# EAGLE schematic testing (EAGLE 9.2.2)
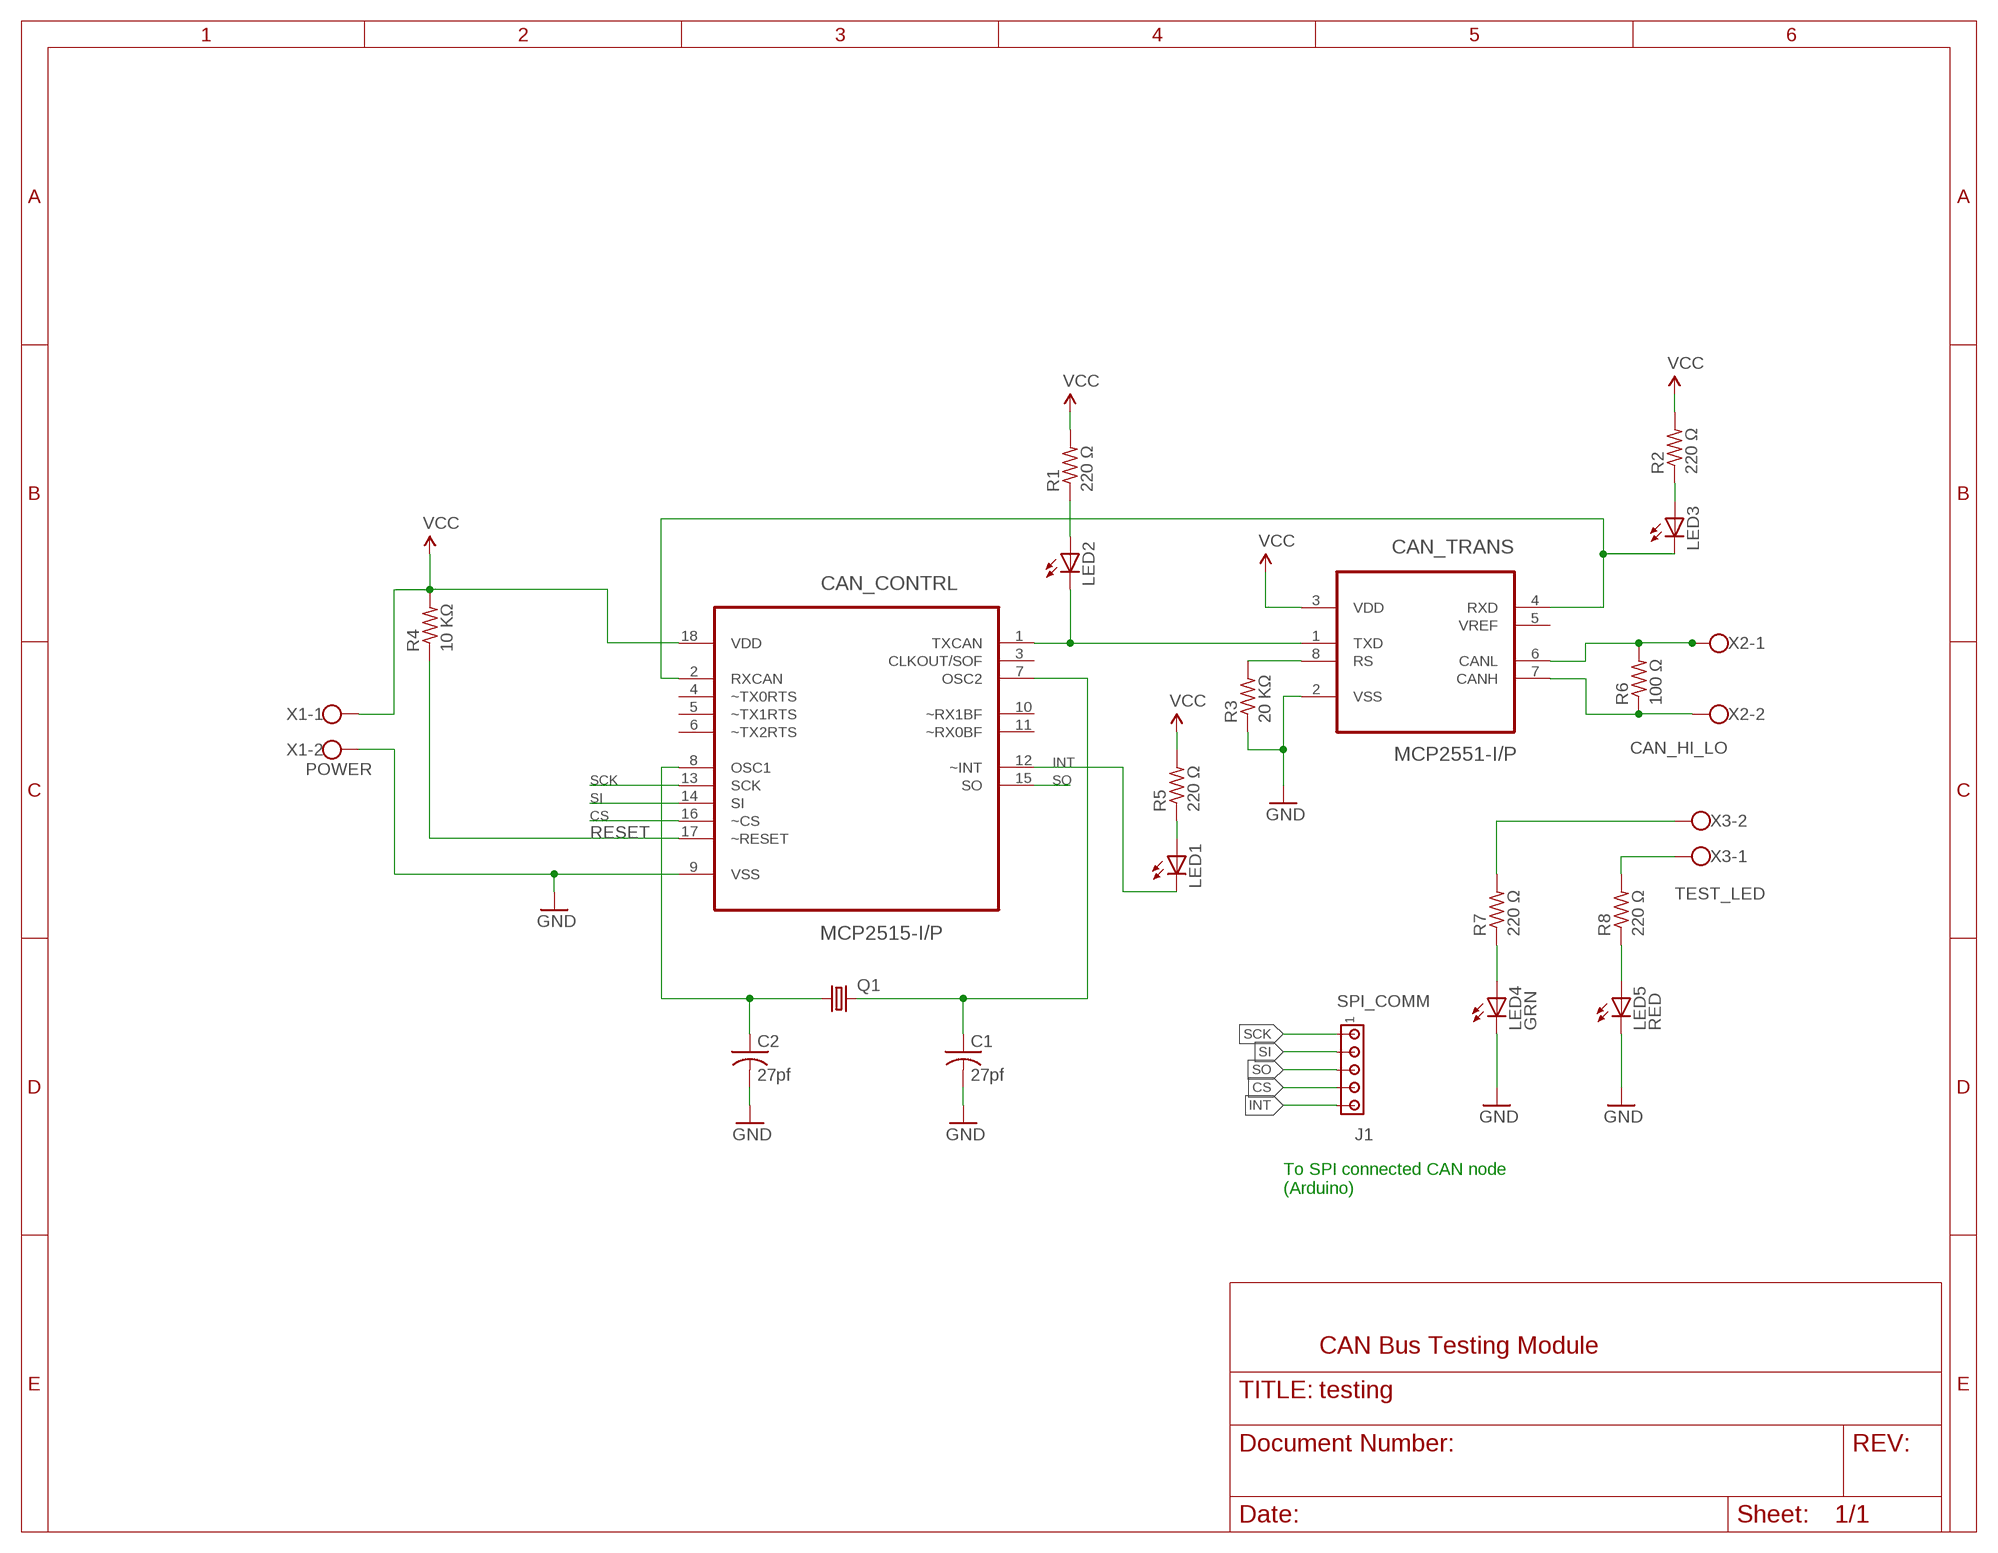
[diagram p0: schematic, sheet 1]

## Parts
C1  27pf  C-US025-040X050  [C025-040X050]
C2  27pf  C-US025-040X050  [C025-040X050]
CAN_CONTRL  MCP2515-I/P  [DIP254P762X432-18]
CAN_TRANS  MCP2551-I/P  [DIP254P762X432-8]
J1  SPI_COMM  MTA05-156  [1X5MTA]
LED1  LED5MM  [LED5MM]
LED2  LED5MM  [LED5MM]
LED3  LED5MM  [LED5MM]
LED4  GRN  LED5MM  [LED5MM]
LED5  RED  LED5MM  [LED5MM]
Q1  CRYTALHC18U-V  [HC18U-V]
R1  220 Ω  R-US_0204/7  [0204/7]
R2  220 Ω  R-US_0204/7  [0204/7]
R3  20 KΩ  R-US_0204/7  [0204/7]
R4  10 KΩ  R-US_0204/7  [0204/7]
R5  220 Ω  R-US_0204/7  [0204/7]
R6  100 Ω  R-US_0204/7  [0204/7]
R7  220 Ω  R-US_0204/7  [0204/7]
R8  220 Ω  R-US_0204/7  [0204/7]
X1  POWER  W237-102  [W237-102]
X2  CAN_HI_LO  W237-102  [W237-102]
X3  TEST_LED  W237-102  [W237-102]

## Nets
CAN_H: CAN_TRANS.7(CANH) R6.1 X2.2
CAN_L: CAN_TRANS.6(CANL) R6.2 X2.1
CS: CAN_CONTRL.16(~CS) J1.4
GND [power]: C1.2 C2.2 CAN_CONTRL.9(VSS) CAN_TRANS.2(VSS) LED4.K(C) LED5.K(C) R3.1 X1.2
INT: CAN_CONTRL.12(~INT) J1.5 LED1.K(C)
N$1: R7.2 X3.2
N$2: R8.2 X3.1
N$3: C2.1 CAN_CONTRL.8(OSC1) Q1.1
N$4: C1.1 CAN_CONTRL.7(OSC2) Q1.2
N$5: LED1.A R5.1
N$6: LED2.A R1.1
N$7: LED4.A R7.1
N$9: LED3.A R2.1
N$10: LED5.A R8.1
N$13: CAN_TRANS.8(RS) R3.2
RESET: CAN_CONTRL.17(~RESET) R4.1
RXCAN: CAN_CONTRL.2(RXCAN) CAN_TRANS.4(RXD) LED3.K(C)
SCK: CAN_CONTRL.13(SCK) J1.1
SI: CAN_CONTRL.14(SI) J1.2
SO: CAN_CONTRL.15(SO) J1.3
TXCAN: CAN_CONTRL.1(TXCAN) CAN_TRANS.1(TXD) LED2.K(C)
VCC [power]: CAN_CONTRL.18(VDD) CAN_TRANS.3(VDD) R1.2 R2.2 R4.2 R5.2 X1.1
Unconnected: CAN_CONTRL.3(CLKOUT/SOF) CAN_CONTRL.4(~TX0RTS) CAN_CONTRL.5(~TX1RTS) CAN_CONTRL.6(~TX2RTS) CAN_CONTRL.10(~RX1BF) CAN_CONTRL.11(~RX0BF) CAN_TRANS.5(VREF)

## Notes on the sheet
- To SPI connected CAN node
  (Arduino)
- CAN Bus Testing Module

## Library data of the parts
C1 C2 = adafruit:C-US: CAPACITOR, American symbol
CAN_CONTRL = Microchip_By_element14_Batch_1:MCP2515-I/P: Stand-Alone CAN Controller; DESCRIPTION: CAN CONTRL; MPN: MCP2515-I/P; OC_FARNELL: 1439391; OC_NEWARK: 61K2945; PACKAGE: PDIP-18; SUPPLIER: MICROCHIP
CAN_TRANS = Microchip_By_element14_Batch_1:MCP2551-I/P: High-Speed CAN Transceiver; DESCRIPTION: CAN CTRL; MPN: MCP2551-I/P; OC_FARNELL: 1292240; OC_NEWARK: 61K2947; PACKAGE: PDIP-8; SUPPLIER: Microchip
J1 = con-amp:MTA05-156: AMP connector
LED1-LED5 = adafruit:LED: LED OSRAM: - CHIPLED LG R971, LG N971, LY N971, LG Q971, LY Q971, LO R971, LY R971 LH N974, LH R974 LS Q976, LO Q976, LY Q976 LO Q996 - Hyper CHIPLED LW Q18S LB Q993, LB Q99A, LB R99A - SideLED LS A670, LO A670, LY A670, LG A670, LP A670 LB A673, LV A673, LT A673, LW A673 LH A674 LY A675 LS A676, LA A676, LO A676, LY A676, LW A676 LS A679, LY A679, LG A679 - Hyper Micro SIDELED® LS Y876, LA Y876, LO Y876, LY Y876 LT Y87S - SmartLED LW L88C, LW L88S LB L89C, LB L89S, LG L890 LS L89K, LO L89K, LY L89K LS L896, LA L896, LO L896, LY L896 - TOPLED LS T670, LO T670, LY T670, LG T670, LP T670 LSG T670, LSP T670, LSY T670, LOP T670, LYG T670 LG T671, LOG T671, LSG T671 LB T673, LV T673, LT T673, LW T673 LH T674 LS T676, LA T676, LO T676, LY T676, LB T676, LH T676, LSB T676, LW T676 LB T67C, LV T67C, LT T67C, LS T67K, LO T67K, LY T67K, LW E67C LS E67B, LA E67B, LO E67B, LY E67B, LB E67C, LV E67C, LT E67C LW T67C LS T679, LY T679, LG T679 LS T770, LO T770, LY T770, LG T770, LP T770 LB T773, LV T773, LT T773, LW T773 LH T774 LS E675, LA E675, LY E675, LS T675 LS T776, LA T776, LO T776, LY T776, LB T776 LHGB T686 LT T68C, LB T68C - Hyper Mini TOPLED® LB M676 - Mini TOPLED Santana® LG M470 LS M47K, LO M47K, LY M47K Source: http://www.osram.convergy.de/
Q1 = crystal:CRYTAL: CRYSTAL
R1-R8 = adafruit:R-US_: RESISTOR, American symbol
X1-X3 = con-wago-500:W237-102: WAGO SCREW CLAMP; MPN: 237-102; OC_FARNELL: unknown; OC_NEWARK: 70K9898

## Net classes
0 default: width 0.762 mm, drill 0.508 mm, clearance 0.305 mm
1 power: width 1.27 mm, drill 0.508 mm, clearance 0.508 mm